# EAGLE schematic controller (EAGLE 7.5.0)
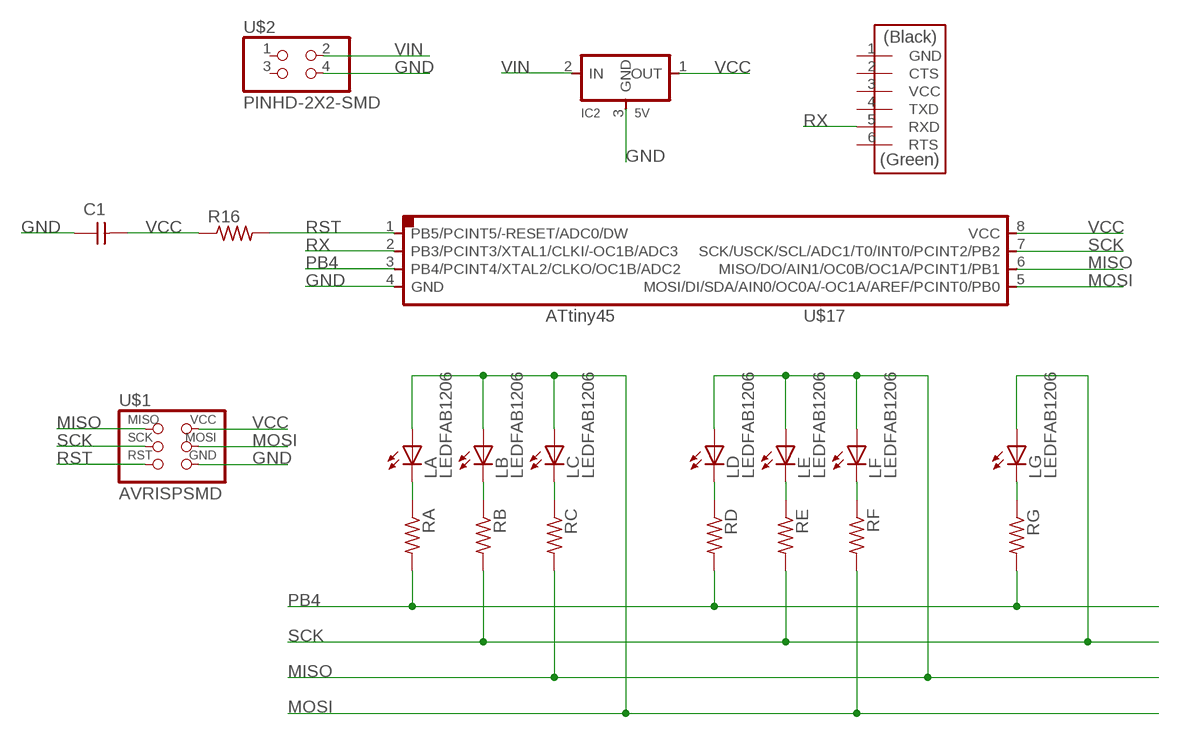
[diagram p0: schematic, sheet 1]

## Parts
C1  CAP-UNPOLARIZEDFAB  [C1206FAB]
IC2  5V  REGULATORSOT23  [SOT23]
LA  LEDFAB1206  [LED1206FAB]
LB  LEDFAB1206  [LED1206FAB]
LC  LEDFAB1206  [LED1206FAB]
LD  LEDFAB1206  [LED1206FAB]
LE  LEDFAB1206  [LED1206FAB]
LF  LEDFAB1206  [LED1206FAB]
LG  LEDFAB1206  [LED1206FAB]
R16  RES-US1206FAB  [R1206FAB]
RA  RES-US1206FAB  [R1206FAB]
RB  RES-US1206FAB  [R1206FAB]
RC  RES-US1206FAB  [R1206FAB]
RD  RES-US1206FAB  [R1206FAB]
RE  RES-US1206FAB  [R1206FAB]
RF  RES-US1206FAB  [R1206FAB]
RG  RES-US1206FAB  [R1206FAB]
U$1  AVRISPSMD  [2X03SMD]
U$2  PINHD-2X2-SMD  [2X02SMD]
U$3  FTDI-SMD-HEADER  [1X06SMD]
U$17  ATTINY45SI  [SOIC8]

## Nets
GND: C1.1 IC2.3(GND) U$1.6(GND) U$2.4 U$17.4(GND)
MISO: LD.1(A) LE.1(A) LF.1(A) RC.2 U$1.1(MISO) U$17.6(MISO/DO/AIN1/OC0B/OC1A/PCINT1/PB1)
MOSI: LA.1(A) LB.1(A) LC.1(A) RF.2 U$1.4(MOSI) U$17.5(MOSI/DI/SDA/AIN0/OC0A/-OC1A/AREF/PCINT0/PB0)
N$2: LA.2(C) RA.1
N$4: LB.2(C) RB.1
N$5: LC.2(C) RC.1
N$6: LD.2(C) RD.1
N$7: LE.2(C) RE.1
N$8: LF.2(C) RF.1
N$11: LG.2(C) RG.1
PB4: RA.2 RD.2 RG.2 U$17.3(PB4/PCINT4/XTAL2/CLKO/OC1B/ADC2)
RST: R16.2 U$1.5(RST) U$17.1(PB5/PCINT5/-RESET/ADC0/DW)
RX: U$3.5(RXD) U$17.2(PB3/PCINT3/XTAL1/CLKI/-OC1B/ADC3)
SCK: LG.1(A) RB.2 RE.2 U$1.3(SCK) U$17.7(SCK/USCK/SCL/ADC1/T0/INT0/PCINT2/PB2)
VCC: C1.2 IC2.1(OUT) R16.1 U$1.2(VCC) U$17.8(VCC)
VIN: IC2.2(IN) U$2.2
Unconnected: U$2.1 U$2.3 U$3.1(GND) U$3.2(CTS) U$3.3(VCC) U$3.4(TXD) U$3.6(RTS)

## Library data of the parts
C1 = fab:CAP-UNPOLARIZED
IC2 = fab:REGULATOR
LA LB LC LD LE LF LG = fab:LED: LED
R16 RA RB RC RD RE RF RG = fab:RES-US: Resistor (US Symbol) Variants with postfix FAB are widened to allow the routing of internal traces
U$1 = fab:AVRISP
U$2 = fab:PINHD-2X2-SMD
U$3 = fab:FTDI-SMD-HEADER
U$17 = fab:ATTINY45

## Net classes
0 default: width 0.457 mm, clearance 1.626 mm